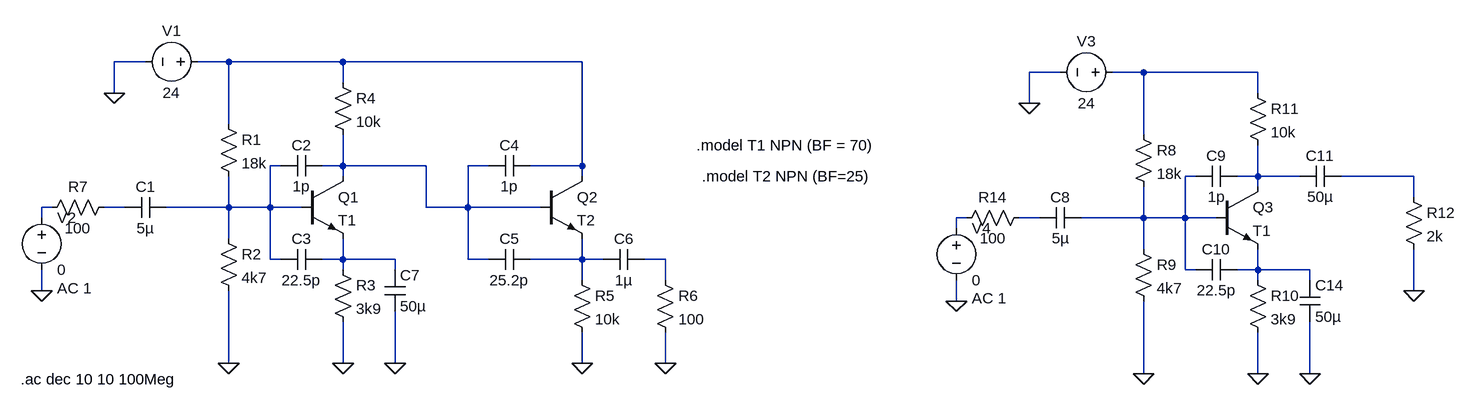
[diagram p0: schematic Ej#3.asc]
Ej#3.asc, the LTspice schematic file:
Version 4
SHEET 1 1924 680
WIRE -352 -112 -400 -112
WIRE -224 -112 -272 -112
WIRE -48 -112 -224 -112
WIRE 320 -112 -48 -112
WIRE 1056 -96 1008 -96
WIRE 1184 -96 1136 -96
WIRE 1360 -96 1184 -96
WIRE -48 -80 -48 -112
WIRE -400 -64 -400 -112
WIRE 1360 -64 1360 -96
WIRE 1008 -48 1008 -96
WIRE -224 -16 -224 -112
WIRE 1184 0 1184 -96
WIRE -144 48 -160 48
WIRE -48 48 -48 0
WIRE -48 48 -80 48
WIRE 80 48 -48 48
WIRE 176 48 144 48
WIRE 320 48 320 -112
WIRE 320 48 240 48
WIRE -48 64 -48 48
WIRE 320 64 320 48
WIRE 1264 64 1248 64
WIRE 1360 64 1360 16
WIRE 1360 64 1328 64
WIRE 1424 64 1360 64
WIRE 1600 64 1488 64
WIRE 1360 80 1360 64
WIRE 1600 96 1600 64
WIRE -496 112 -512 112
WIRE -384 112 -416 112
WIRE -224 112 -224 64
WIRE -224 112 -320 112
WIRE -160 112 -160 48
WIRE -160 112 -224 112
WIRE -112 112 -160 112
WIRE 80 112 80 48
WIRE 144 112 144 48
WIRE 144 112 80 112
WIRE 256 112 144 112
WIRE -512 128 -512 112
WIRE 912 128 896 128
WIRE 1024 128 992 128
WIRE 1184 128 1184 80
WIRE 1184 128 1088 128
WIRE 1248 128 1248 64
WIRE 1248 128 1184 128
WIRE 1296 128 1248 128
WIRE 896 144 896 128
WIRE -224 160 -224 112
WIRE 1184 176 1184 128
WIRE -160 192 -160 112
WIRE -144 192 -160 192
WIRE -48 192 -48 160
WIRE -48 192 -80 192
WIRE 32 192 -48 192
WIRE 144 192 144 112
WIRE 176 192 144 192
WIRE 320 192 320 160
WIRE 320 192 240 192
WIRE 352 192 320 192
WIRE 448 192 416 192
WIRE -48 208 -48 192
WIRE 32 208 32 192
WIRE 1248 208 1248 128
WIRE 1264 208 1248 208
WIRE 1360 208 1360 176
WIRE 1360 208 1328 208
WIRE 1440 208 1360 208
WIRE 320 224 320 192
WIRE 448 224 448 192
WIRE 1360 224 1360 208
WIRE 1440 224 1440 208
WIRE -512 240 -512 208
WIRE 1600 240 1600 176
WIRE 896 256 896 224
WIRE -224 352 -224 240
WIRE -48 352 -48 288
WIRE 32 352 32 272
WIRE 320 352 320 304
WIRE 448 352 448 304
WIRE 1184 368 1184 256
WIRE 1360 368 1360 304
WIRE 1440 368 1440 288
FLAG -48 352 0
FLAG 320 352 0
FLAG 448 352 0
FLAG -224 352 0
FLAG -512 240 0
FLAG -400 -64 0
FLAG 32 352 0
FLAG 1360 368 0
FLAG 1184 368 0
FLAG 896 256 0
FLAG 1008 -48 0
FLAG 1440 368 0
FLAG 1600 240 0
SYMBOL npn -112 64 R0
SYMATTR InstName Q1
SYMATTR Value T1
SYMBOL npn 256 64 R0
SYMATTR InstName Q2
SYMATTR Value T2
SYMBOL res -240 -32 R0
SYMATTR InstName R1
SYMATTR Value 18k
SYMBOL res -240 144 R0
SYMATTR InstName R2
SYMATTR Value 4k7
SYMBOL res -64 192 R0
SYMATTR InstName R3
SYMATTR Value 3k9
SYMBOL res -64 -96 R0
SYMATTR InstName R4
SYMATTR Value 10k
SYMBOL res 304 208 R0
SYMATTR InstName R5
SYMATTR Value 10k
SYMBOL res 432 208 R0
SYMATTR InstName R6
SYMATTR Value 100
SYMBOL res -400 96 R90
WINDOW 0 0 56 VBottom 2
WINDOW 3 32 56 VTop 2
SYMATTR InstName R7
SYMATTR Value 100
SYMBOL cap -320 96 R90
WINDOW 0 0 32 VBottom 2
WINDOW 3 32 32 VTop 2
SYMATTR InstName C1
SYMATTR Value 5µ
SYMBOL cap -80 32 R90
WINDOW 0 0 32 VBottom 2
WINDOW 3 32 32 VTop 2
SYMATTR InstName C2
SYMATTR Value 1p
SYMBOL cap -80 176 R90
WINDOW 0 0 32 VBottom 2
WINDOW 3 32 32 VTop 2
SYMATTR InstName C3
SYMATTR Value 22.5p
SYMBOL cap 240 32 R90
WINDOW 0 0 32 VBottom 2
WINDOW 3 32 32 VTop 2
SYMATTR InstName C4
SYMATTR Value 1p
SYMBOL cap 240 176 R90
WINDOW 0 0 32 VBottom 2
WINDOW 3 32 32 VTop 2
SYMATTR InstName C5
SYMATTR Value 25.2p
SYMBOL voltage -256 -112 R90
WINDOW 0 -32 56 VBottom 2
WINDOW 3 32 56 VTop 2
WINDOW 123 0 0 Left 0
WINDOW 39 0 0 Left 0
SYMATTR InstName V1
SYMATTR Value 24
SYMBOL cap 416 176 R90
WINDOW 0 0 32 VBottom 2
WINDOW 3 32 32 VTop 2
SYMATTR InstName C6
SYMATTR Value 1µ
SYMBOL voltage -512 112 R0
WINDOW 123 24 124 Left 2
WINDOW 39 0 0 Left 0
SYMATTR InstName V2
SYMATTR Value 0
SYMATTR Value2 AC 1
SYMBOL cap 16 208 R0
SYMATTR InstName C7
SYMATTR Value 50µ
SYMBOL npn 1296 80 R0
SYMATTR InstName Q3
SYMATTR Value T1
SYMBOL res 1168 -16 R0
SYMATTR InstName R8
SYMATTR Value 18k
SYMBOL res 1168 160 R0
SYMATTR InstName R9
SYMATTR Value 4k7
SYMBOL res 1344 208 R0
SYMATTR InstName R10
SYMATTR Value 3k9
SYMBOL res 1344 -80 R0
SYMATTR InstName R11
SYMATTR Value 10k
SYMBOL res 1008 112 R90
WINDOW 0 0 56 VBottom 2
WINDOW 3 32 56 VTop 2
SYMATTR InstName R14
SYMATTR Value 100
SYMBOL cap 1088 112 R90
WINDOW 0 0 32 VBottom 2
WINDOW 3 32 32 VTop 2
SYMATTR InstName C8
SYMATTR Value 5µ
SYMBOL cap 1328 48 R90
WINDOW 0 0 32 VBottom 2
WINDOW 3 32 32 VTop 2
SYMATTR InstName C9
SYMATTR Value 1p
SYMBOL cap 1328 192 R90
WINDOW 0 0 32 VBottom 2
WINDOW 3 32 32 VTop 2
SYMATTR InstName C10
SYMATTR Value 22.5p
SYMBOL voltage 1152 -96 R90
WINDOW 0 -32 56 VBottom 2
WINDOW 3 32 56 VTop 2
WINDOW 123 0 0 Left 0
WINDOW 39 0 0 Left 0
SYMATTR InstName V3
SYMATTR Value 24
SYMBOL voltage 896 128 R0
WINDOW 123 24 124 Left 2
WINDOW 39 0 0 Left 0
SYMATTR InstName V4
SYMATTR Value 0
SYMATTR Value2 AC 1
SYMBOL cap 1424 224 R0
SYMATTR InstName C14
SYMATTR Value 50µ
SYMBOL cap 1488 48 R90
WINDOW 0 0 32 VBottom 2
WINDOW 3 32 32 VTop 2
SYMATTR InstName C11
SYMATTR Value 50µ
SYMBOL res 1584 80 R0
SYMATTR InstName R12
SYMATTR Value 2k
TEXT 496 16 Left 2 !.model T1 NPN (BF = 70)
TEXT 504 64 Left 2 !.model T2 NPN (BF=25)
TEXT -544 376 Left 2 !.ac dec 10 10 100Meg

The netlist it stands for:
* Ej#3.asc
Q1 N004 N003 N012 0 T1
Q2 N001 N004 N013 0 T2
R1 N001 N003 18k
R2 N003 0 4k7
R3 N012 0 3k9
R4 N001 N004 10k
R5 N013 0 10k
R6 N014 0 100
R7 N009 N008 100
C1 N003 N009 5µ
C2 N004 N003 1p
C3 N012 N003 22.5p
C4 N001 N004 1p
C5 N013 N004 25.2p
V1 N001 0 24
C6 N014 N013 1µ
V2 N008 0 0 AC 1
C7 N012 0 50µ
Q3 N006 N005 N015 0 T1
R8 N002 N005 18k
R9 N005 0 4k7
R10 N015 0 3k9
R11 N002 N006 10k
R14 N011 N010 100
C8 N005 N011 5µ
C9 N006 N005 1p
C10 N015 N005 22.5p
V3 N002 0 24
V4 N010 0 0 AC 1
C14 N015 0 50µ
C11 N007 N006 50µ
R12 N007 0 2k
.model NPN NPN
.model PNP PNP
.lib standard.bjt
.model T1 NPN (BF = 70)
.model T2 NPN (BF=25)
.ac dec 10 10 100Meg
.backanno
.end